# EAGLE schematic tombol (EAGLE 6.3)
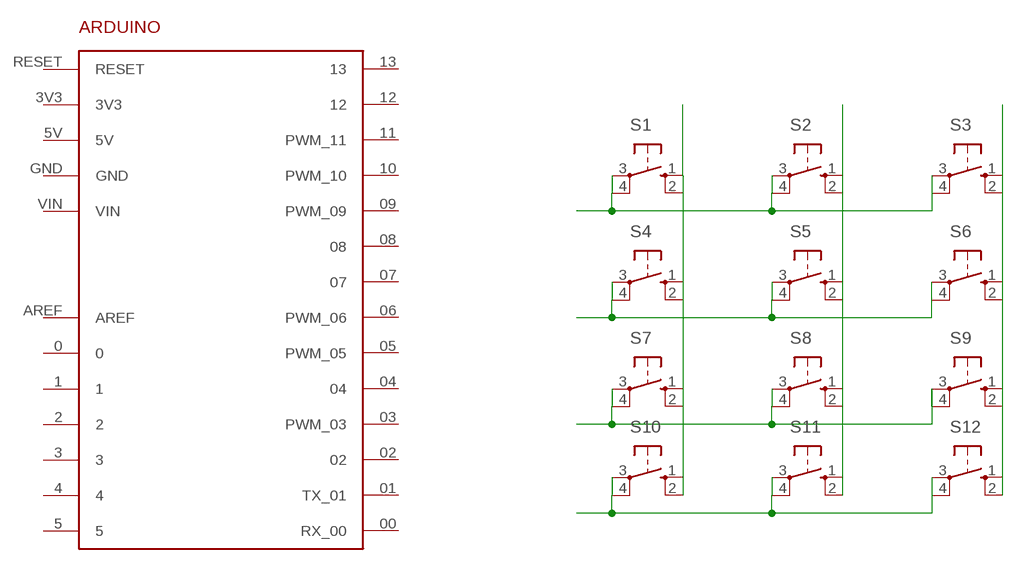
[diagram p0: schematic, sheet 1]

## Parts
ARDUINO1  ARDUINO  [ARDUINO]
S1  10-XX  [B3F-10XX]
S2  10-XX  [B3F-10XX]
S3  10-XX  [B3F-10XX]
S4  10-XX  [B3F-10XX]
S5  10-XX  [B3F-10XX]
S6  10-XX  [B3F-10XX]
S7  10-XX  [B3F-10XX]
S8  10-XX  [B3F-10XX]
S9  10-XX  [B3F-10XX]
S10  10-XX  [B3F-10XX]
S11  10-XX  [B3F-10XX]
S12  10-XX  [B3F-10XX]

## Nets
N$1: S1.1(S) S1.2(S1) S4.1(S) S4.2(S1) S7.1(S) S7.2(S1) S10.1(S) S10.2(S1)
N$2: S2.1(S) S2.2(S1) S5.1(S) S5.2(S1) S8.1(S) S8.2(S1) S11.1(S) S11.2(S1)
N$3: S3.1(S) S3.2(S1) S6.1(S) S6.2(S1) S9.1(S) S9.2(S1) S12.1(S) S12.2(S1)
N$4: S1.3(P) S1.4(P1) S2.3(P) S2.4(P1) S3.3(P) S3.4(P1)
N$5: S4.3(P) S4.4(P1) S5.3(P) S5.4(P1) S6.3(P) S6.4(P1)
N$6: S7.3(P) S7.4(P1) S8.3(P) S8.4(P1) S9.3(P) S9.4(P1)
N$7: S10.3(P) S10.4(P1) S11.3(P) S11.4(P1) S12.3(P) S12.4(P1)
Unconnected: ARDUINO1.0 ARDUINO1.00(RX_00) ARDUINO1.1 ARDUINO1.01(TX_01) ARDUINO1.02 ARDUINO1.2 ARDUINO1.3 ARDUINO1.03(PWM_03) ARDUINO1.3V3 ARDUINO1.04 ARDUINO1.4 ARDUINO1.5 ARDUINO1.05(PWM_05) ARDUINO1.5V ARDUINO1.06(PWM_06) ARDUINO1.07 ARDUINO1.08 ARDUINO1.09(PWM_09) ARDUINO1.10(PWM_10) ARDUINO1.11(PWM_11) ARDUINO1.12 ARDUINO1.13 ARDUINO1.AREF ARDUINO1.GND ARDUINO1.RESET ARDUINO1.VIN

## Library data of the parts
ARDUINO1 = arduino:ARDUINO: For creating Arduino shields
S1-S12 = switch-omron:10-XX: OMRON SWITCH; MPN: B3F-1000; OC_FARNELL: 176432; OC_NEWARK: 36M3542